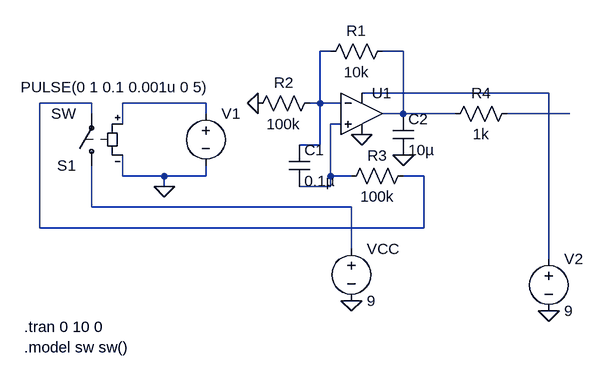
[diagram p0: schematic doorbell_lm741.asc]
doorbell_lm741.asc, the LTspice schematic file:
Version 4
SHEET 1 936 680
WIRE 224 64 208 64
WIRE 336 64 304 64
WIRE 560 128 272 128
WIRE -144 144 -224 144
WIRE 32 144 -96 144
WIRE 208 144 208 64
WIRE 208 144 192 144
WIRE 240 144 208 144
WIRE -144 160 -144 144
WIRE 32 160 32 144
WIRE 336 160 336 64
WIRE 336 160 304 160
WIRE 416 160 336 160
WIRE 592 160 496 160
WIRE -96 176 -96 144
WIRE 240 176 224 176
WIRE 208 208 208 144
WIRE 208 208 176 208
WIRE -96 256 -96 224
WIRE -32 256 -96 256
WIRE 32 256 32 240
WIRE 32 256 -32 256
WIRE 224 256 224 176
WIRE 256 256 224 256
WIRE 368 256 336 256
WIRE -32 272 -32 256
WIRE 224 272 224 256
WIRE 224 272 176 272
WIRE -144 304 -144 240
WIRE 256 304 -144 304
WIRE -224 336 -224 144
WIRE 368 336 368 256
WIRE 368 336 -224 336
WIRE 256 368 256 304
WIRE 560 384 560 128
FLAG -32 272 0
FLAG 256 448 0
FLAG 336 224 0
FLAG 560 464 0
FLAG 272 192 0
FLAG 112 144 0
SYMBOL res 320 48 R90
WINDOW 0 0 56 VBottom 2
WINDOW 3 32 56 VTop 2
SYMATTR InstName R1
SYMATTR Value 10k
SYMBOL res 208 128 R90
WINDOW 0 0 56 VBottom 2
WINDOW 3 32 56 VTop 2
SYMATTR InstName R2
SYMATTR Value 100k
SYMBOL cap 160 208 R0
SYMATTR InstName C1
SYMATTR Value 0.1µ
SYMBOL res 352 240 R90
WINDOW 0 0 56 VBottom 2
WINDOW 3 32 56 VTop 2
SYMATTR InstName R3
SYMATTR Value 100k
SYMBOL sw -144 256 R180
SYMATTR InstName S1
SYMBOL voltage 32 144 R0
WINDOW 3 -285 -25 Left 2
WINDOW 123 0 0 Left 0
WINDOW 39 0 0 Left 0
SYMATTR InstName V1
SYMATTR Value PULSE(0 1 0.1 0.001u 0 5)
SYMBOL voltage 256 352 R0
WINDOW 123 0 0 Left 0
WINDOW 39 0 0 Left 0
SYMATTR InstName VCC
SYMATTR Value 9
SYMBOL cap 320 160 R0
SYMATTR InstName C2
SYMATTR Value 10µ
SYMBOL res 512 144 R90
WINDOW 0 0 56 VBottom 2
WINDOW 3 32 56 VTop 2
SYMATTR InstName R4
SYMATTR Value 1k
SYMBOL voltage 560 368 R0
WINDOW 123 0 0 Left 0
WINDOW 39 0 0 Left 0
SYMATTR InstName V2
SYMATTR Value 9
SYMBOL OpAmps\\UniversalOpAmp 272 160 R0
SYMATTR InstName U1
TEXT -248 488 Left 2 !.tran 0 10 0
TEXT -248 520 Left 2 !.model sw sw()

The netlist it stands for:
* doorbell_lm741.asc
R1 N002 N001 10k
R2 N001 0 100k
C1 N001 N007 0.1µ
R3 N004 N007 100k
S1 N008 N004 N005 0 SW
V1 N005 0 PULSE(0 1 0.1 0.001u 0 5)
VCC N008 0 9
C2 N002 0 10µ
R4 N006 N002 1k
V2 N003 0 9
XU1 N007 N001 N003 0 N002 level1 Avol=1Meg GBW=10Meg Vos=0 En=0 Enk=0 In=0 Ink=0 Rin=500Meg  ; pins In+ In- V+ V- OUT
.tran 0 10 0
.model sw sw()
.lib UniversalOpAmp1.lib
.backanno
.end